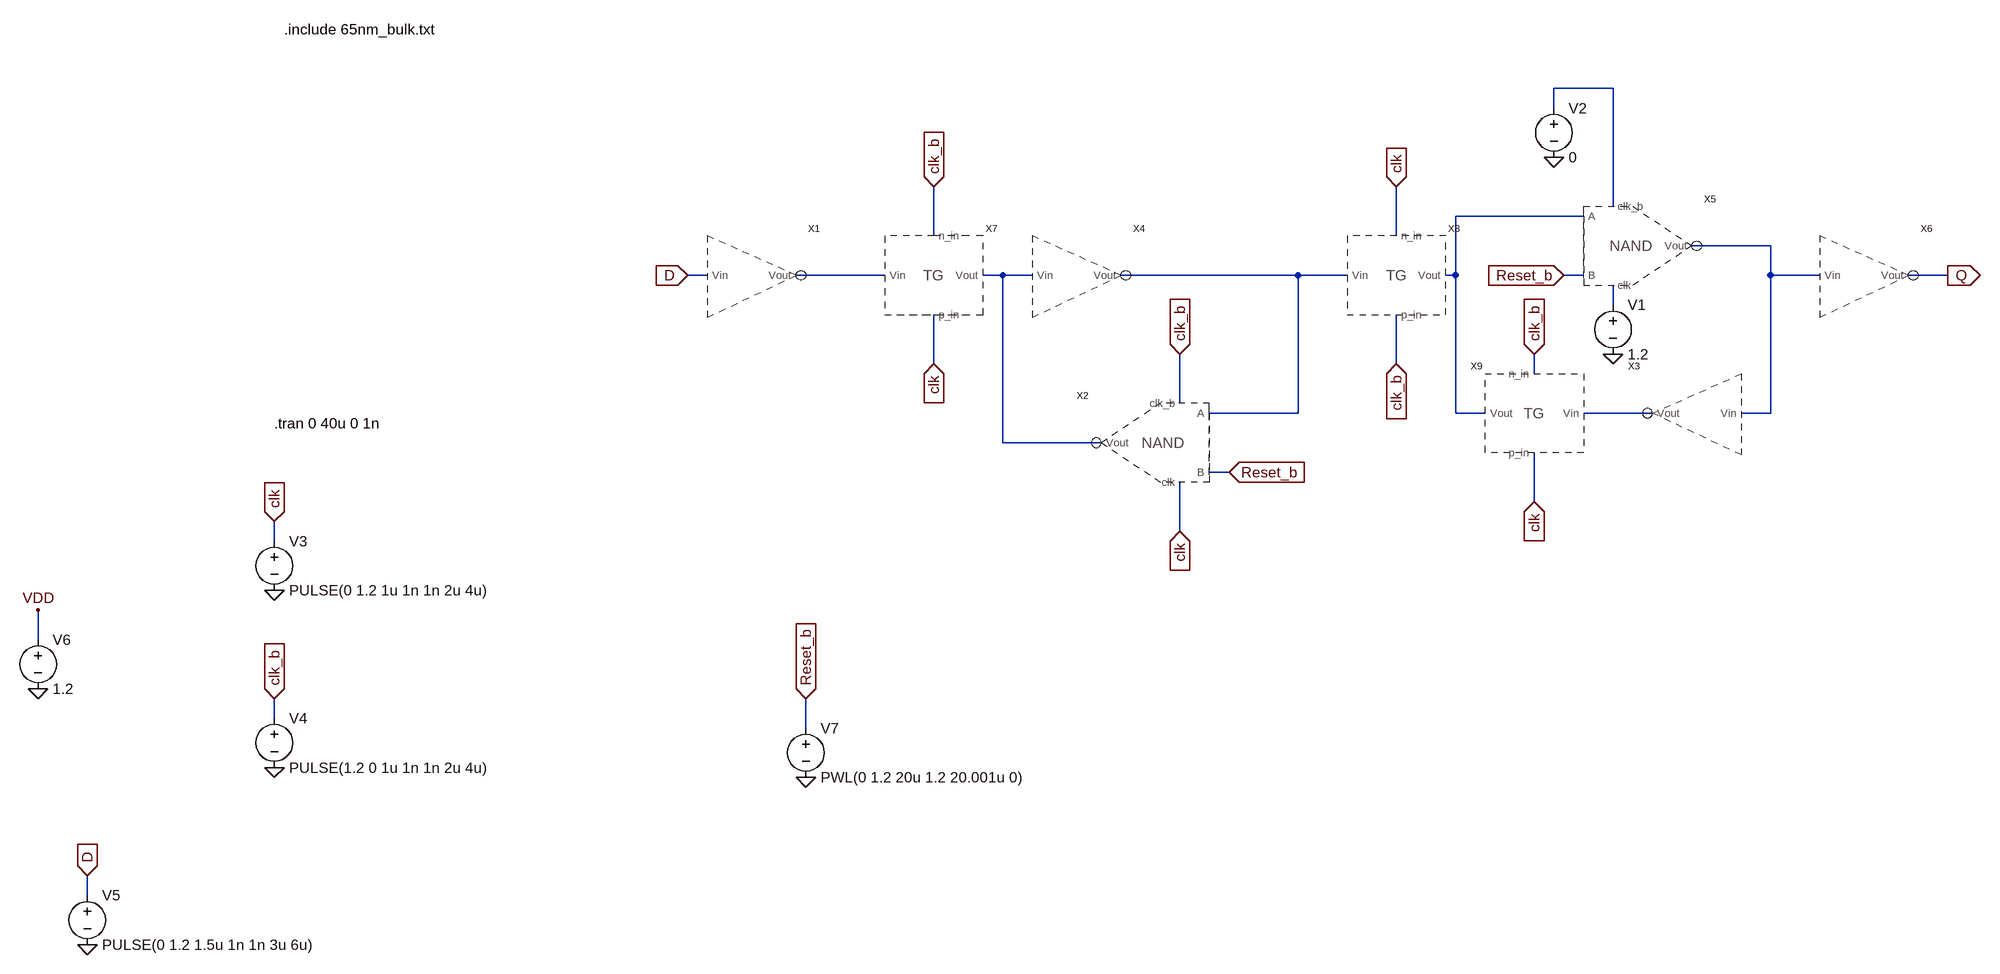
[diagram p0: schematic dff_with_Reset.asc]
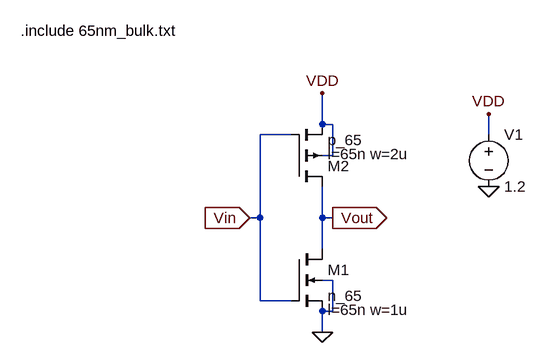
[diagram p1: sub-circuit inverter.asc]
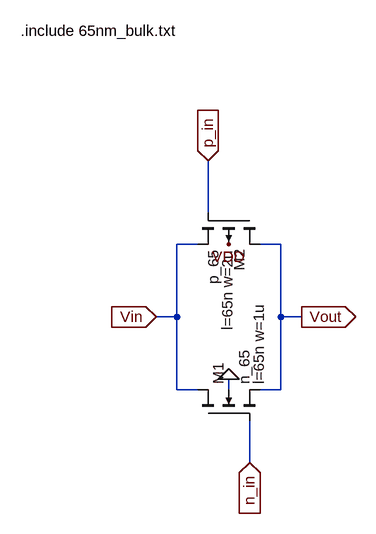
[diagram p2: sub-circuit transmission_gate.asc]
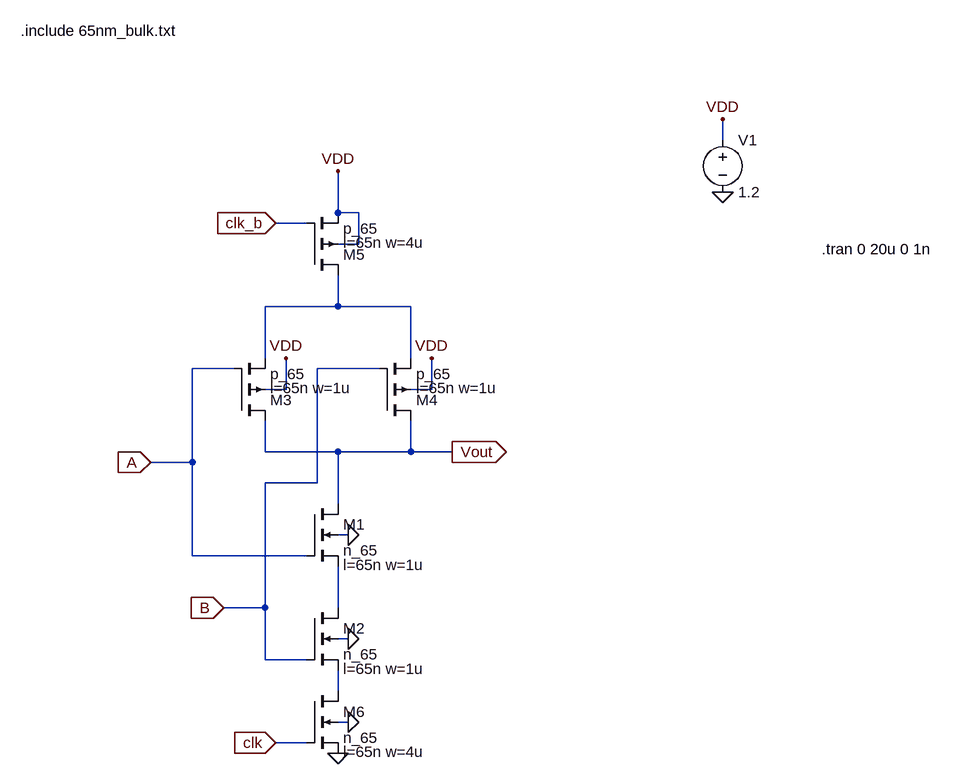
[diagram p3: sub-circuit nand_sym.asc]
dff_with_Reset.asc, the LTspice schematic file:
Version 4
SHEET 1 1808 1504
WIRE 1200 96 1104 96
WIRE 1104 128 1104 96
WIRE 1200 288 1200 96
WIRE 1152 304 944 304
WIRE 96 336 96 256
WIRE 848 336 848 256
WIRE 1456 352 1328 352
WIRE -272 400 -304 400
WIRE 16 400 -128 400
WIRE 208 400 176 400
WIRE 256 400 208 400
WIRE 688 400 400 400
WIRE 768 400 688 400
WIRE 944 400 944 304
WIRE 944 400 928 400
WIRE 1152 400 1120 400
WIRE 1456 400 1456 352
WIRE 1536 400 1456 400
WIRE 1744 400 1680 400
WIRE 1200 448 1200 416
WIRE 96 544 96 464
WIRE 848 544 848 464
WIRE 1072 560 1072 528
WIRE 496 608 496 528
WIRE 688 624 688 400
WIRE 688 624 544 624
WIRE 944 624 944 400
WIRE 992 624 944 624
WIRE 1264 624 1152 624
WIRE 1456 624 1456 400
WIRE 1456 624 1408 624
WIRE 208 672 208 400
WIRE 368 672 208 672
WIRE 576 720 544 720
WIRE 1072 768 1072 688
WIRE 496 816 496 736
WIRE -976 832 -976 800
WIRE -1360 992 -1360 944
WIRE -976 1120 -976 1088
WIRE -112 1136 -112 1088
WIRE -1280 1408 -1280 1376
FLAG 96 256 clk_b
IOPIN 96 256 In
FLAG 96 544 clk
IOPIN 96 544 In
FLAG 848 256 clk
IOPIN 848 256 In
FLAG 848 544 clk_b
IOPIN 848 544 In
FLAG 1072 528 clk_b
IOPIN 1072 528 In
FLAG 1072 768 clk
IOPIN 1072 768 In
FLAG -304 400 D
IOPIN -304 400 In
FLAG 1744 400 Q
IOPIN 1744 400 Out
FLAG 496 816 clk
IOPIN 496 816 In
FLAG 496 528 clk_b
IOPIN 496 528 In
FLAG 576 720 Reset_b
IOPIN 576 720 In
FLAG 1120 400 Reset_b
IOPIN 1120 400 In
FLAG 1200 528 0
FLAG 1104 208 0
FLAG -976 800 clk
IOPIN -976 800 In
FLAG -976 912 0
FLAG -976 1088 clk_b
IOPIN -976 1088 In
FLAG -976 1200 0
FLAG -1280 1376 D
IOPIN -1280 1376 In
FLAG -1280 1488 0
FLAG -1360 944 VDD
FLAG -1360 1072 0
FLAG -112 1088 Reset_b
IOPIN -112 1088 In
FLAG -112 1216 0
SYMBOL inverter -208 400 R0
SYMATTR InstName X1
SYMBOL inverter 1344 624 M0
SYMATTR InstName X3
SYMBOL inverter 320 400 R0
SYMATTR InstName X4
SYMBOL inverter 1600 400 R0
SYMATTR InstName X6
SYMBOL transmission_gate 96 400 R0
SYMATTR InstName X7
SYMBOL transmission_gate 848 400 R0
SYMATTR InstName X8
SYMBOL transmission_gate 1072 624 M0
SYMATTR InstName X9
SYMBOL nand_sym 464 672 M0
SYMATTR InstName X2
SYMBOL nand_sym 1232 352 R0
SYMATTR InstName X5
SYMBOL Voltage 1200 432 R0
SYMATTR InstName V1
SYMATTR Value 1.2
SYMBOL Voltage 1104 112 R0
SYMATTR InstName V2
SYMATTR Value 0
SYMBOL Voltage -976 816 R0
SYMATTR InstName V3
SYMATTR Value PULSE(0 1.2 1u 1n 1n 2u 4u)
SYMBOL Voltage -976 1104 R0
SYMATTR InstName V4
SYMATTR Value PULSE(1.2 0 1u 1n 1n 2u 4u)
SYMBOL Voltage -1280 1392 R0
SYMATTR InstName V5
SYMATTR Value PULSE(0 1.2 1.5u 1n 1n 3u 6u)
SYMBOL Voltage -1360 976 R0
SYMATTR InstName V6
SYMATTR Value 1.2
SYMBOL Voltage -112 1120 R0
SYMATTR InstName V7
SYMATTR Value PWL(0 1.2 20u 1.2 20.001u 0)
TEXT -960 0 Left 2 !.include 65nm_bulk.txt
TEXT -976 640 Left 2 !.tran 0 40u 0 1n

inverter.asc, the sub-circuit schematic file:
Version 4
SHEET 1 880 680
WIRE 400 224 400 176
WIRE 416 224 400 224
WIRE 352 240 304 240
WIRE 656 240 656 208
WIRE 416 272 416 224
WIRE 416 272 400 272
WIRE 304 368 304 240
WIRE 304 368 288 368
WIRE 400 368 400 320
WIRE 416 368 400 368
WIRE 400 416 400 368
WIRE 416 464 400 464
WIRE 304 496 304 368
WIRE 352 496 304 496
WIRE 416 512 416 464
WIRE 416 512 400 512
WIRE 400 544 400 512
FLAG 400 544 0
FLAG 400 176 VDD
FLAG 656 208 VDD
FLAG 656 320 0
FLAG 288 368 Vin
IOPIN 288 368 In
FLAG 416 368 Vout
IOPIN 416 368 Out
SYMBOL nmos4 352 416 R0
WINDOW 123 56 94 Left 2
SYMATTR InstName M1
SYMATTR Value n_65
SYMATTR Value2 l=65n w=1u
SYMBOL pmos4 352 320 M180
WINDOW 123 56 50 Left 2
SYMATTR InstName M2
SYMATTR Value p_65
SYMATTR Value2 l=65n w=2u
SYMBOL Voltage 656 224 R0
SYMATTR InstName V1
SYMATTR Value 1.2
TEXT -64 80 Left 2 !.include 65nm_bulk.txt

transmission_gate.asc, the sub-circuit schematic file:
Version 4
SHEET 1 880 924
WIRE 64 368 64 288
WIRE 48 416 16 416
WIRE 176 416 144 416
WIRE 16 528 16 416
WIRE 16 528 -16 528
WIRE 176 528 176 416
WIRE 208 528 176 528
WIRE 16 640 16 528
WIRE 48 640 16 640
WIRE 96 640 96 624
WIRE 176 640 176 528
WIRE 176 640 144 640
WIRE 128 752 128 688
FLAG 96 624 0
FLAG 96 416 VDD
FLAG 128 752 n_in
IOPIN 128 752 In
FLAG 64 288 p_in
IOPIN 64 288 In
FLAG -16 528 Vin
IOPIN -16 528 In
FLAG 208 528 Vout
IOPIN 208 528 Out
SYMBOL nmos4 48 688 R270
WINDOW 123 56 94 Left 2
SYMATTR Value2 l=65n w=1u
SYMATTR InstName M1
SYMATTR Value n_65
SYMBOL pmos4 144 368 R90
WINDOW 123 56 50 Left 2
SYMATTR Value2 l=65n w=2u
SYMATTR InstName M2
SYMATTR Value p_65
TEXT -224 88 Left 2 !.include 65nm_bulk.txt

nand_sym.asc, the sub-circuit schematic file:
Version 4
SHEET 1 1728 992
WIRE 592 -240 592 -272
WIRE 0 -128 0 -192
WIRE 32 -128 0 -128
WIRE -48 -112 -96 -112
WIRE 32 -80 32 -128
WIRE 32 -80 0 -80
WIRE 0 16 0 -32
WIRE 0 16 -112 16
WIRE 112 16 0 16
WIRE -112 96 -112 16
WIRE 112 96 112 16
WIRE -160 112 -224 112
WIRE 64 112 -32 112
WIRE -80 144 -80 96
WIRE -80 144 -112 144
WIRE 144 144 144 96
WIRE 144 144 112 144
WIRE -112 240 -112 192
WIRE 0 240 -112 240
WIRE 112 240 112 192
WIRE 112 240 0 240
WIRE 176 240 112 240
WIRE -224 256 -224 112
WIRE -224 256 -288 256
WIRE -32 288 -32 112
WIRE -32 288 -112 288
WIRE 0 320 0 240
WIRE 16 368 0 368
WIRE -224 400 -224 256
WIRE -48 400 -224 400
WIRE -112 480 -112 288
WIRE -112 480 -176 480
WIRE 0 480 0 416
WIRE 16 528 0 528
WIRE -112 560 -112 480
WIRE -48 560 -112 560
WIRE 0 608 0 576
WIRE 16 656 0 656
WIRE -48 688 -96 688
FLAG 0 -192 VDD
FLAG 16 368 0
FLAG 16 528 0
FLAG -288 256 A
IOPIN -288 256 In
FLAG -176 480 B
IOPIN -176 480 In
FLAG -80 96 VDD
FLAG 144 96 VDD
FLAG 16 656 0
FLAG 0 704 0
FLAG -96 -112 clk_b
IOPIN -96 -112 In
FLAG -96 688 clk
IOPIN -96 688 In
FLAG 176 240 Vout
IOPIN 176 240 Out
FLAG 592 -272 VDD
FLAG 592 -160 0
SYMBOL nmos4 -48 320 R0
WINDOW 123 56 94 Left 2
SYMATTR Value2 l=65n w=1u
SYMATTR InstName M1
SYMATTR Value n_65
SYMBOL nmos4 -48 480 R0
WINDOW 123 56 94 Left 2
SYMATTR Value2 l=65n w=1u
SYMATTR InstName M2
SYMATTR Value n_65
SYMBOL pmos4 -160 192 M180
WINDOW 123 56 50 Left 2
SYMATTR Value2 l=65n w=1u
SYMATTR InstName M3
SYMATTR Value p_65
SYMBOL pmos4 64 192 M180
WINDOW 123 56 50 Left 2
SYMATTR Value2 l=65n w=1u
SYMATTR InstName M4
SYMATTR Value p_65
SYMBOL pmos4 -48 -32 M180
WINDOW 123 56 50 Left 2
SYMATTR Value2 l=65n w=4u
SYMATTR InstName M5
SYMATTR Value p_65
SYMBOL nmos4 -48 608 R0
WINDOW 123 56 94 Left 2
SYMATTR Value2 l=65n w=4u
SYMATTR InstName M6
SYMATTR Value n_65
SYMBOL Voltage 592 -256 R0
SYMATTR InstName V1
SYMATTR Value 1.2
TEXT -488 -408 Left 2 !.include 65nm_bulk.txt
TEXT 744 -72 Left 2 !.tran 0 20u 0 1n

The netlist it stands for:
* dff_with_Reset.asc
XX1 D N004 inverter
XX3 N003 N008 inverter
XX4 N005 N006 inverter
XX6 N003 Q inverter
XX7 clk_b clk N004 N005 transmission_gate
XX8 clk clk_b N006 N002 transmission_gate
XX9 clk_b clk N008 N002 transmission_gate
XX2 N006 Reset_b clk clk_b N005 nand_sym
XX5 N002 Reset_b N007 N001 N003 nand_sym
V1 N007 0 1.2
V2 N001 0 0
V3 clk 0 PULSE(0 1.2 1u 1n 1n 2u 4u)
V4 clk_b 0 PULSE(1.2 0 1u 1n 1n 2u 4u)
V5 D 0 PULSE(0 1.2 1.5u 1n 1n 3u 6u)
V6 VDD 0 1.2
V7 Reset_b 0 PWL(0 1.2 20u 1.2 20.001u 0)

* block symbol definitions
.subckt inverter Vin Vout
M1 Vout Vin 0 0 n_65 l=65n w=1u
M2 Vout Vin VDD VDD p_65 l=65n w=2u
V1 VDD 0 1.2
.include 65nm_bulk.txt
.ends inverter

.subckt transmission_gate n_in p_in Vin Vout
M1 Vin n_in Vout 0 n_65 l=65n w=1u
M2 Vout p_in Vin VDD p_65 l=65n w=2u
.include 65nm_bulk.txt
.ends transmission_gate

.subckt nand_sym A B clk clk_b Vout
M1 Vout A N002 0 n_65 l=65n w=1u
M2 N002 B N003 0 n_65 l=65n w=1u
M3 Vout A N001 VDD p_65 l=65n w=1u
M4 Vout B N001 VDD p_65 l=65n w=1u
M5 N001 clk_b VDD VDD p_65 l=65n w=4u
M6 N003 clk 0 0 n_65 l=65n w=4u
V1 VDD 0 1.2
.include 65nm_bulk.txt
.tran 0 20u 0 1n
.ends nand_sym

.model NMOS NMOS
.model PMOS PMOS
.lib standard.mos
.include 65nm_bulk.txt
.tran 0 40u 0 1n
.backanno
.end